# EAGLE board Ell-i-proto (EAGLE 6.4)
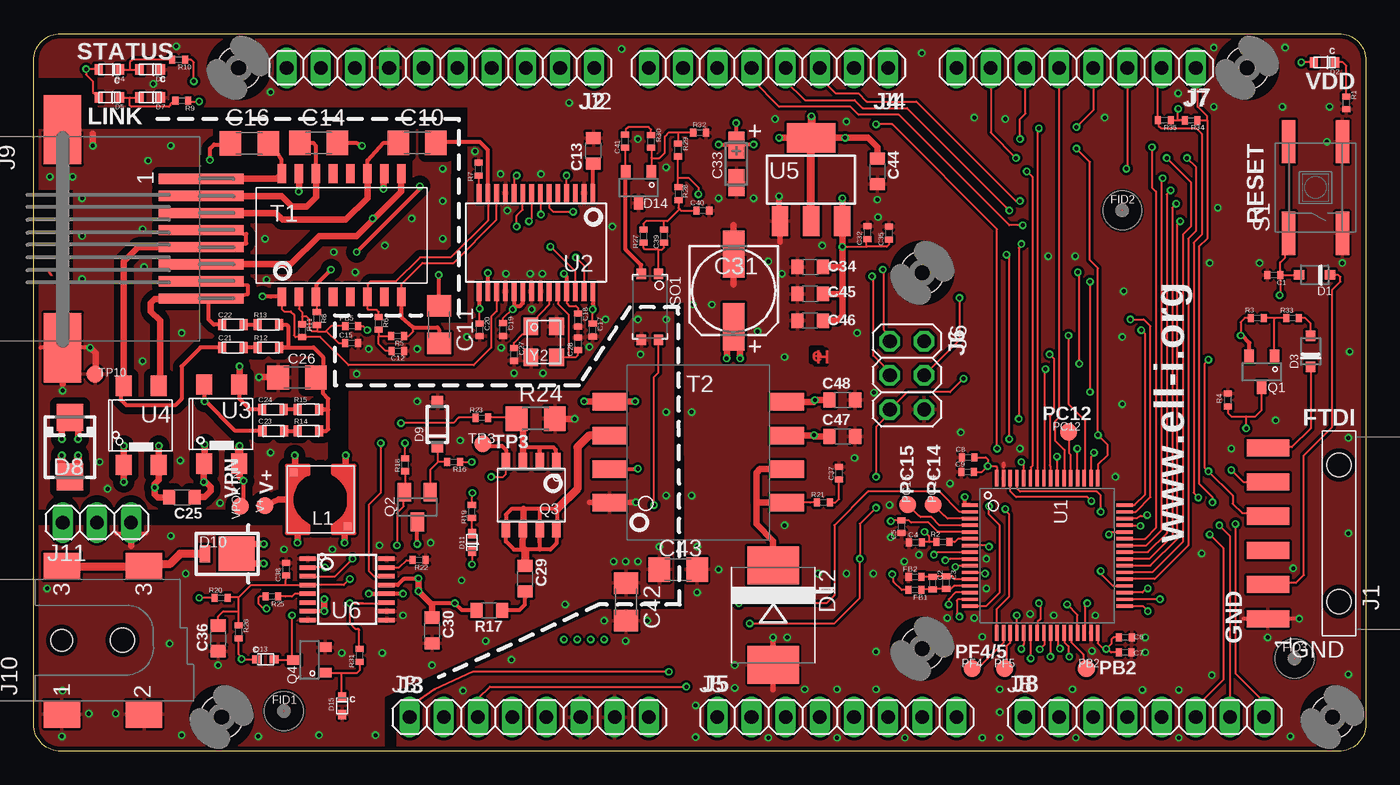
[diagram p3: board, top side]
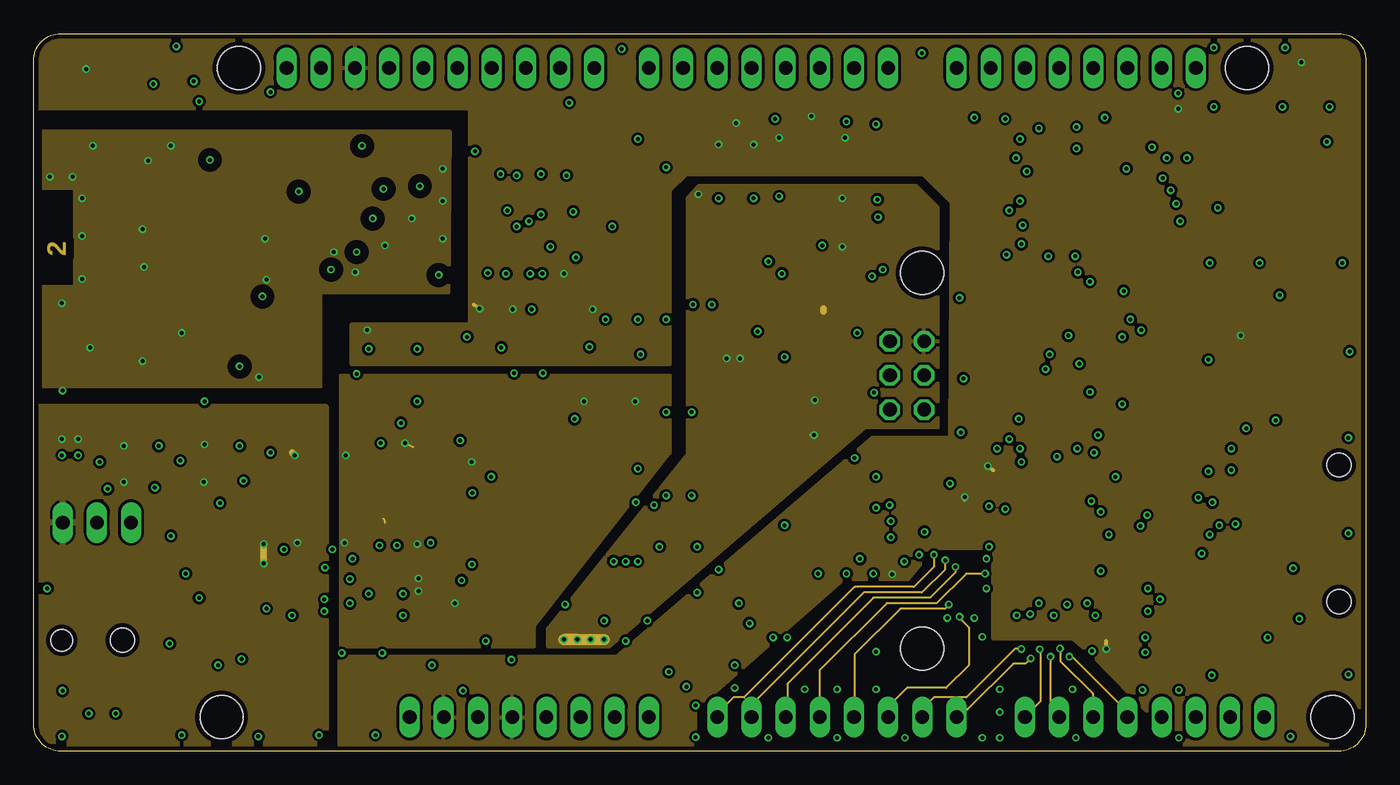
[diagram p4: board, inner layer Layer2]
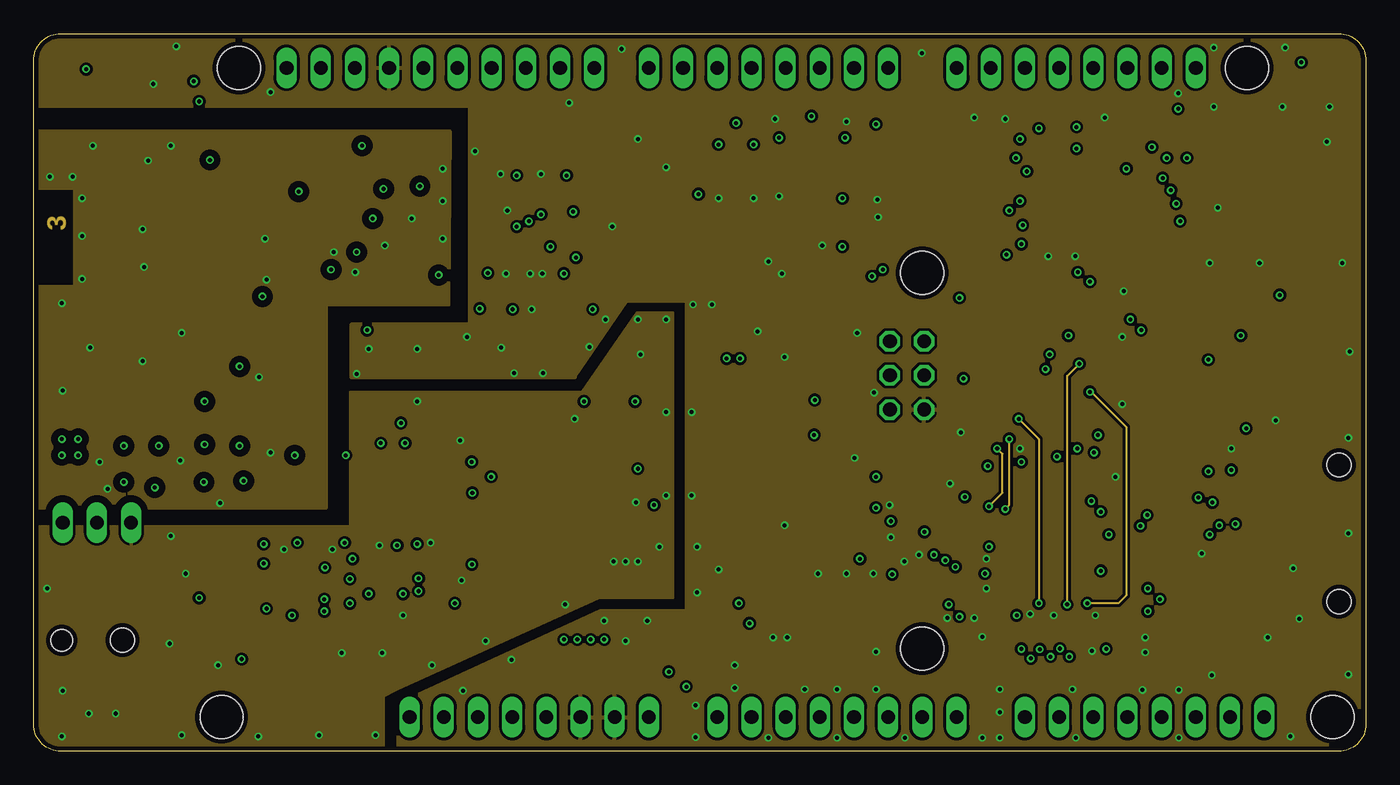
[diagram p5: board, inner layer Layer3]
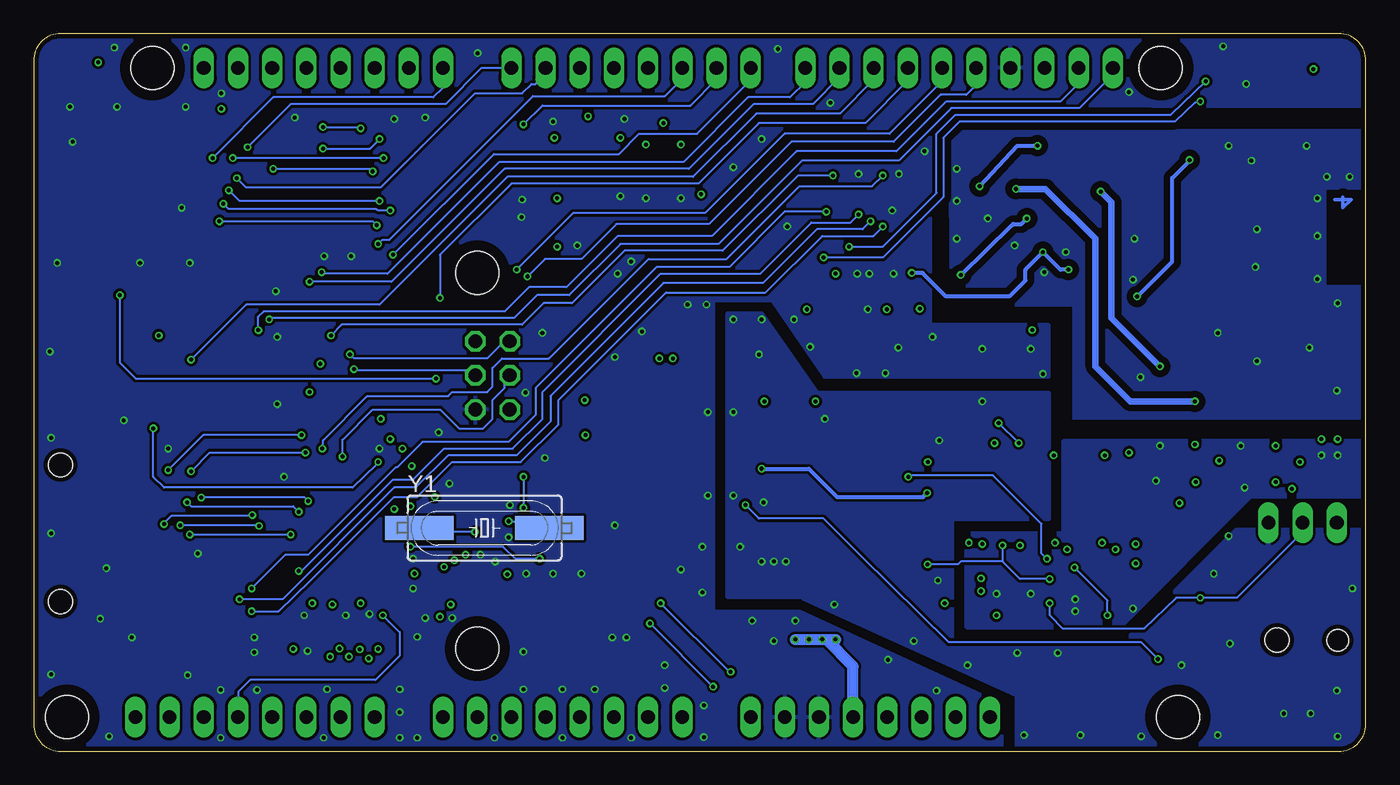
[diagram p6: board, bottom side, seen from below]

Size 99 x 53.34 mm. Coordinates in mm from the lower left corner, seen from the top.
Outline: 97,0 2,0 arc-90 0,2 0,51.34 arc-90 2,53.34 97,53.34 arc-90 99,51.34 99,2 arc-90 97,0
Copper layers (1*2*15*16): Top 0.035mm / dielectric 0.2mm / Layer2 0.035mm / dielectric 1mm / Layer3 0.035mm / dielectric 0.2mm / Bottom 0.035mm
Design rules "Ell-duino *": minimum track width 0.15mm, minimum drill 0.3mm, track to track 0.2mm, track to pad 0.2mm, pad to pad 0.2mm, via to via 0.2mm, smd to smd 0mil, copper to edge 0.35mm, drill to drill 0.4mm, minimum pad ring 10mil, minimum via ring 0.125mm, stop-mask expansion 2mil, vias tented up to drill 0.29mm, thermal gap 0.18mm
Net classes: 0 default: width 0.1 mm, drill 0.3 mm, clearance 0.1 mm; 1 power: width 0.3 mm, drill 0.3 mm, clearance 0.15 mm; 2 high_voltage: width 0.15 mm, drill 0.3 mm, clearance 0.5 mm; 3 high_power: width 0.5 mm, drill 0.3 mm, clearance 0.15 mm
tRestrict: area 37.2,33.9 to 37.5,34.5; area 26,10.1 to 26.5,10.2; area 26,9.4 to 26.5,9.5; area 25.9,14.6 to 26.4,14.7; area 20.1,14.6 to 20.6,14.7; area 20.1,9.4 to 20.6,9.5; area 21.1,21.6 to 21.6,21.6; area 32.6,43.6 to 32.8,43.9; area 36.3,29.1 to 36.4,29.4; area 9.3,49.1 to 9.6,49.2; area 9.3,50.1 to 9.6,50.2; area 20.6,15.9 to 22,16

## Footprints (pad centres in the part's own frame; a part is rotated, then mirrored left to right if it is on the bottom)
0402 = smd 0.45 x 0.6: 1 -0.475,0; 2 0.475,0
C1206 = smd 1.6 x 1.8: 1 -1.4,0; 2 1.4,0
0805 = smd 0.9 x 1.1: 1 -0.95,0; 2 0.95,0
0603 = smd 0.6 x 0.8: 1 -0.8,0; 2 0.8,0
153CLV-0605 = smd 3.5 x 1.6: + 2.7,0; - -2.7,0
CT3216 = smd 2 x 1.2: + -1.4,0; - 1.4,0
SOD323_DIODE = smd 0.8 x 0.7: 1 -1.15,0; 2 1.15,0
DIODE0603 = smd 0.6 x 0.8: 1 -0.8,0; 2 0.8,0
SMA = smd 2 x 2: 1 -2.2,0; 2 2.2,0
SOD-123 = smd 0.85 x 0.85: A 1.675,0; C -1.675,0
SMP = smd 0.762 x 1.27: A 1.651,0 | smd 2.667 x 2.54: C -0.699,0
SOD523 = smd 0.7 x 0.6: 1 -0.65,0; 2 0.65,0
SMC = smd 2.8 x 3.8: 1 -3.7,0; 2 3.7,0
SOT23 = smd 0.7 x 1: 1 -0.95,-1.15; 2 0.95,-1.15; 3 0,1.15
MOUNT_FIDUCIAL = smd 1 x 1: P$1 0,0
MOUNT_HOLE = hole 3.2: 0,0
PS2911 = smd 0.7 x 0.8: 1 -0.635,-2.45; 2 0.635,-2.45; 3 0.635,2.45; 4 -0.635,2.45
TSM-106-01-L-SH-REV = smd 1.27 x 3.17: 1 -6.35,5.28; 2 -3.81,5.28; 3 -1.27,5.28; 4 1.27,5.28; 5 3.81,5.28; 6 6.35,5.28 | hole 1.78: 5.08,0; -5.08,0
1X10 = drill 1.016 long: 1 -11.43,0; 2 -8.89,0; 3 -6.35,0; 4 -3.81,0; 5 -1.27,0; 6 1.27,0; 7 3.81,0; 8 6.35,0; 9 8.89,0; 10 11.43,0
1X08 = drill 1.016 long: 1 -8.89,0; 2 -6.35,0; 3 -3.81,0; 4 -1.27,0; 5 1.27,0; 6 3.81,0; 7 6.35,0; 8 8.89,0
2X03 = drill 1.016 octagon: 1 -2.54,-1.27; 2 -2.54,1.27; 3 0,-1.27; 4 0,1.27; 5 2.54,-1.27; 6 2.54,1.27
85502-5008 = smd 0.76 x 6.35: 1 -4.445,10.3; 2 -3.175,10.3; 3 -1.905,10.3; 4 -0.635,10.3; 5 0.635,10.3; 6 1.905,10.3; 7 3.175,10.3; 8 4.445,10.3 | smd 5.15 x 2.8: S1 -8.1,0; S2 8.1,0
KLDX-SMT2-0202 = smd 2 x 2.7: 1 -5.5,0; 2 -5.5,-6.1; 3@1 5.5,0; 3@2 5.5,-6.1 | hole 1.6: 0,0 | hole 1.8: 0,-4.5
1X03 = drill 1.016 long: 1 -2.54,0; 2 0,0; 3 2.54,0
MSS5121 = smd 0.6 x 0.6: 1 -2,-2; 2 2,2
B1,27 = smd 1.27 x 1.27: TP 0,0
SOT23' = smd 1 x 1.4: 1 -0.95,-1.1; 2 0.95,-1.1; 3 0,1.1
SO8 = smd 0.635 x 1.27: P$1 -1.875,-2.5; P$2 -0.625,-2.5; P$3 0.625,-2.5; P$4 1.875,-2.5; P$5 1.875,2.5; P$6 0.625,2.5; P$7 -0.625,2.5; P$8 -1.875,2.5
R1206 = smd 1.6 x 1.803: 1 -1.422,0; 2 1.422,0
EVQQ2/P0 = smd 3.2 x 1: 1 3.4,-2; 2 -3.4,-2; 3 3.4,2; 4 -3.4,2
H2019NL = smd 0.635 x 1.397: 1 -4.445,-4.572; 2 -3.175,-4.572; 3 -1.905,-4.572; 4 -0.635,-4.572; 5 0.635,-4.572; 6 1.905,-4.572; 7 3.175,-4.572; 8 4.445,-4.572; 9 4.445,4.572; 10 3.175,4.572; 11 1.905,4.572; 12 0.635,4.572; 13 -0.635,4.572; 14 -1.905,4.572; 15 -3.175,4.572; 16 -4.445,4.572
PA1134NL = smd 1.3 x 2.5: 1 3.75,-6.6; 2 1.25,-6.6; 3 -1.25,-6.6; 4 -3.75,-6.6; 5 -3.75,6.6; 6 -1.25,6.6; 7 1.25,6.6; 8 3.75,6.6
LQFP64 = smd 0.25 x 1.2: 1 -3.75,-5.75; 2 -3.25,-5.75; 3 -2.75,-5.75; 4 -2.25,-5.75; 5 -1.75,-5.75; 6 -1.25,-5.75; 7 -0.75,-5.75; 8 -0.25,-5.75; 9 0.25,-5.75; 10 0.75,-5.75; 11 1.25,-5.75; 12 1.75,-5.75; 13 2.25,-5.75; 14 2.75,-5.75; 15 3.25,-5.75; 16 3.75,-5.75; 33 3.75,5.75; 34 3.25,5.75; 35 2.75,5.75; 36 2.25,5.75; 37 1.75,5.75; 38 1.25,5.75; 39 0.75,5.75; 40 0.25,5.75; 41 -0.25,5.75; 42 -0.75,5.75; 43 -1.25,5.75; 44 -1.75,5.75; 45 -2.25,5.75; 46 -2.75,5.75; 47 -3.25,5.75; 48 -3.75,5.75 | smd 1.2 x 0.25: 17 5.75,-3.75; 18 5.75,-3.25; 19 5.75,-2.75; 20 5.75,-2.25; 21 5.75,-1.75; 22 5.75,-1.25; 23 5.75,-0.75; 24 5.75,-0.25; 25 5.75,0.25; 26 5.75,0.75; 27 5.75,1.25; 28 5.75,1.75; 29 5.75,2.25; 30 5.75,2.75; 31 5.75,3.25; 32 5.75,3.75; 49 -5.75,3.75; 50 -5.75,3.25; 51 -5.75,2.75; 52 -5.75,2.25; 53 -5.75,1.75; 54 -5.75,1.25; 55 -5.75,0.75; 56 -5.75,0.25; 57 -5.75,-0.25; 58 -5.75,-0.75; 59 -5.75,-1.25; 60 -5.75,-1.75; 61 -5.75,-2.25; 62 -5.75,-2.75; 63 -5.75,-3.25; 64 -5.75,-3.75
SSOP28DB = smd 0.348 x 1.397: 1 -4.225,-3.656; 2 -3.575,-3.656; 3 -2.925,-3.656; 4 -2.275,-3.656; 5 -1.625,-3.656; 6 -0.975,-3.656; 7 -0.325,-3.656; 8 0.325,-3.656; 9 0.975,-3.656; 10 1.625,-3.656; 11 2.275,-3.656; 12 2.925,-3.656; 13 3.575,-3.656; 14 4.225,-3.656; 15 4.225,3.656; 16 3.575,3.656; 17 2.925,3.656; 18 2.275,3.656; 19 1.625,3.656; 20 0.975,3.656; 21 0.325,3.656; 22 -0.325,3.656; 23 -0.975,3.656; 24 -1.625,3.656; 25 -2.275,3.656; 26 -2.925,3.656; 27 -3.575,3.656; 28 -4.225,3.656
MINIDIP4 = smd 1.2 x 1.5: 1 -1.3,-2.95; 2 1.3,-2.95; 3 1.3,2.95; 4 -1.3,2.95
SOT223 = smd 1.219 x 2.235: 1 -2.311,-3.099; 2 0,-3.099; 3 2.311,-3.099 | smd 3.6 x 2.2: 4 0,3.099
SSOP16 = smd 0.35 x 1.2: 1 -2.275,-2.925; 2 -1.625,-2.925; 3 -0.975,-2.925; 4 -0.325,-2.925; 5 0.325,-2.925; 6 0.975,-2.925; 7 1.625,-2.925; 8 2.275,-2.925; 9 2.275,2.925; 10 1.625,2.925; 11 0.975,2.925; 12 0.325,2.925; 13 -0.325,2.925; 14 -0.975,2.925; 15 -1.625,2.925; 16 -2.275,2.925
SM49 = smd 5.08 x 1.778: 1 -4.826,0; 2 4.826,0
XTAL3225 = smd 1.3 x 1.1: 1 -1.15,-0.95; 2 1.15,-0.95; 3 1.15,0.95; 4 -1.15,0.95

## Placement (x,y rotation side)
C1  100nF  [0402]  92.15,35.39 180 top
C2  1uF  [0402]  66.81,12.49 270 top
C3  10nF  [0402]  67.81,12.53 270 top
C4  22pF  [0402]  65.53,15.51 0 top
C5  22pF  [0402]  64.49,16.69 90 top
C6  100nF  [0402]  81.12,8.45 180 top
C7  1uF  [0402]  81.11,7.35 180 top
C8  1uF  [0402]  69.45,21.85 0 top
C9  100nF  [0402]  69.41,20.75 0 top
C10  10nF  [C1206]  28.5,45.22 0 top
C11  10nF  [C1206]  30.12,31.71 270 top
C12  100nF  [0402]  27.07,29.75 0 top
C13  22uF  [0805]  41.59,44.63 90 top
C14  10nF  [C1206]  21.18,45.22 0 top
C15  100nF  [0402]  23.63,30.35 0 top
C16  10nF  [C1206]  16.03,45.18 180 top
C17  100nF  [0402]  41.55,31.31 270 top
C18  100nF  [0402]  40.45,32.05 270 top
C19  100nF  [0402]  34.9,31.35 270 top
C20  100nF  [0402]  33.15,31.33 270 top
C21  10nF  [0603]  14.82,30.01 0 top
C22  10nF  [0603]  14.81,31.71 0 top
C23  10nF  [0603]  17.8,23.81 0 top
C24  10nF  [0603]  17.79,25.41 0 top
C25  100nF  [0805]  11.03,18.88 180 top
C26  1nF  [C1206]  19.57,27.78 180 top
C27  22pF  [0402]  35.7,29.5 270 top
C28  22pF  [0402]  40.45,30.29 90 top
C29  68pF  [0805]  36.52,12.84 270 top
C30  1uF  [0805]  29.62,8.98 270 top
C31  [153CLV-0605]  52.02,34.25 270 top
C32  100nF  [0402]  61.95,38.55 90 top
C33  opt tant  [CT3216]  52.22,43.65 270 top
C34  22u  [0805]  57.7,36 180 top
C35  47pF  [0402]  63.55,38.51 90 top
C36  4u7  [0805]  13.72,8.39 270 top
C37  470pF  [0402]  59.85,20.67 90 top
C38  100nF  [0402]  18.75,13.53 90 top
C39  33nF  [0402]  46.85,38.29 90 top
C40  [0402]  49.73,40.19 0 top
C41  27nF  [0402]  43.95,45.35 90 top
C42  1n 2kV  [C1206]  44.02,11.1 270 top
C43  1n 2kV  [C1206]  47.9,13.5 0 top
C44  22u  [0805]  62.7,43.1 270 top
C45  22u  [0805]  57.7,34 180 top
C46  22u  [0805]  57.7,32 180 top
C47  22u  [0805]  60.1,23.4 0 top
C48  22u  [0805]  60.1,26.1 0 top
D1  BAT60J  [SOD323_DIODE]  95.19,35.4 180 top
D2  GRN  [DIODE0603]  95.92,51.19 180 top
D3  BAT60J  [SOD323_DIODE]  94.9,29.73 90 top
D4  STATUS  [DIODE0603]  5.63,50.67 180 top
D5  LINK  [DIODE0603]  5.63,48.59 180 top
D6  STATUS  [DIODE0603]  8.66,50.67 180 top
D7  LINK  [DIODE0603]  8.66,48.59 180 top
D8  [SMA]  2.7,22.6 270 top
D9  MMSZ4694  [SOD-123]  30,24.29 90 top
D10  SS2PH10  [SMP]  14.38,14.68 180 top
D11  BAS516  [SOD523]  32.57,15.53 90 top
D12  MBRS540T3  [SMC]  54.96,10.12 270 top
D13  BAS516  [SOD523]  17.22,6.83 0 top
D14  TLVH431B  [SOT23]  44.95,41.9 180 top
D15  BAS516  [SOD523]  22.93,3.39 270 top
FB1  BLM15A  [0402]  65.49,11.99 180 top
FB2  BLM15A  [0402]  65.5,12.96 0 top
FB5  BLM15A  [0402]  23.64,31.61 0 top
FID1  MOUNT_FIDUCIAL  [MOUNT_FIDUCIAL]  18.6,3 0 top
FID2  MOUNT_FIDUCIAL  [MOUNT_FIDUCIAL]  80.9,40.2 0 top
FID3  MOUNT_FIDUCIAL  [MOUNT_FIDUCIAL]  93.7,6.9 0 top
H1  MOUNT_HOLE  [MOUNT_HOLE]  15.24,50.8 0 top
H2  MOUNT_HOLE  [MOUNT_HOLE]  13.97,2.54 0 top
H3  MOUNT_HOLE  [MOUNT_HOLE]  66.04,35.56 0 top
H4  MOUNT_HOLE  [MOUNT_HOLE]  66.04,7.62 0 top
H5  MOUNT_HOLE  [MOUNT_HOLE]  90.17,50.8 0 top
H6  MOUNT_HOLE  [MOUNT_HOLE]  96.52,2.54 0 top
ISO1  PS2911  [PS2911]  45.8,33.03 180 top
J1  FTDI-SER-6-HOR2  [TSM-106-01-L-SH-REV]  97,16.2 90 top
J2  PWMH  [1X10]  30.23,50.8 180 top
J3  PWR  [1X08]  36.83,2.54 0 top
J4  PWML  [1X08]  54.61,50.8 180 top
J5  ANAL  [1X08]  59.69,2.54 0 top
J6  SPI  [2X03]  64.9,27.94 270 top
J7  COMM  [1X08]  77.47,50.8 0 top
J8  ANAH  [1X08]  82.55,2.54 0 top
J9  RJ45  [85502-5008]  2.15,38.1 270 top
J10  KLDX-SMT2-0202  [KLDX-SMT2-0202]  2.1,8.26 90 top
J11  [1X03]  4.7,17 0 top
L1  3u3  [MSS5121]  21.32,18.71 270 top
PB2  TPSB1,27  [B1,27]  78.23,6.13 0 top
PC12  TPSB1,27  [B1,27]  76.91,23.73 0 top
PC14  TPSB1,27  [B1,27]  66.86,18.33 0 top
PC15  TPSB1,27  [B1,27]  64.96,18.33 0 top
PF4  TPSB1,27  [B1,27]  69.75,6.13 0 top
PF5  TPSB1,27  [B1,27]  72.17,6.13 0 top
Q1  FDV304P  [SOT23]  91.26,28.2 180 top
Q2  MMBTA42  [SOT23']  28.51,18.15 180 top
Q3  Si4848DY  [SO8]  36.98,19.03 180 top
Q4  FDV301N  [SOT23]  20.5,6.79 90 top
R1  150R  [0402]  97.55,48.19 270 top
R2  390R  [0402]  67.57,15.55 0 top
R3  10K  [0402]  90.93,32.2 0 top
R4  10K  [0402]  88.75,26.11 270 top
R5  49R9  [0402]  27.05,30.85 180 top
R6  49R9  [0402]  25.65,31.81 90 top
R7  2K2  [0402]  33.05,43.27 90 top
R8  49R9  [0402]  21.05,32.17 270 top
R9  330R  [0402]  11.01,48.35 180 top
R10  330R  [0402]  10.77,51.41 180 top
R11  49R9  [0402]  19.94,31.26 270 top
R12  75R  [0603]  17.45,30.01 0 top
R13  75R  [0603]  17.44,31.71 0 top
R14  75R  [0603]  20.43,23.81 0 top
R15  75R  [0603]  20.42,25.41 0 top
R16  220K  [0402]  31.2,21.51 180 top
R17  100R  [0805]  33.86,10.48 180 top
R18  220K  [0402]  27.59,21.29 270 top
R19  510R  [0402]  32.56,17.82 90 top
R20  100K  [0402]  13.93,11.39 0 top
R21  10R  [0402]  58.69,18.49 0 top
R22  8K06  [0402]  28.65,14.21 180 top
R23  4K7  [0402]  33.31,24.79 0 top
R24  0R125  [R1206]  37.31,24.72 0 top
R25  45R3  [0402]  17.7,11.5 180 top
R26  6K8  [0402]  15.24,8.87 270 top
R27  1K  [0402]  45.31,38.29 90 top
R28  470R  [0402]  47.91,41.45 90 top
R29  100K  [0402]  47.89,44.69 270 top
R30  47K  [0402]  45.89,45.33 270 top
R31  10K  [0402]  24.21,7.13 90 top
R32  33K2  [0402]  49.49,45.99 0 top
R33  1K  [0402]  93.55,32.19 0 top
R34  2K2  [0402]  86.01,46.89 0 top
R35  2K2  [0402]  84.03,46.91 180 top
S1  EVQQ2/P0  [EVQQ2/P0]  95.26,41.9 90 top
T1  H2019  [H2019NL]  22.89,38.35 0 top
T2  PA1134NL  [PA1134NL]  49.39,22.22 270 top
TP3  TPB1,27  [B1,27]  33.39,22.85 0 top
TP10  TPB1,27  [B1,27]  4.57,28.03 90 top
U1  STM32F05XLQF64  [LQFP64]  75.32,14.54 270 top
U2  ENC28J60SS  [SSOP28DB]  37.33,37.81 180 top
U3  HD01  [MINIDIP4]  13.97,24.32 0 top
U4  HD01  [MINIDIP4]  7.98,24.22 0 top
U5  NCP1117  [SOT223]  57.77,42.49 0 top
U6  LTC4267  [SSOP16]  23.29,12.03 270 top
U$4  [EH-LOGO]  58.1,28.8 0 top
V+  TPB1,27  [B1,27]  17.18,18.25 0 top
VPORTN  TPB1,27  [B1,27]  15.38,18.23 0 top
Y1  [SM49]  65.5,16.6 0 bottom
Y2  25MHz  [XTAL3225]  37.9,30.43 270 top

## Tracks (layer width: path | path; a pad name or v marks a point on that pad's centre or on a via)
+3V3  (via drill 0.3)
  Top 0.15: R35.1 85.52,46.91 | U2.25 39.6,33.3 39.8,33.1 40.3,33.1 40.45,32.95 C18.1 | D4.2 4.8,50.7 v3.9,50.7 3.9,50.3 4.4,49.8 4.4,49 4.8,48.7 4.88,48.62 4.9,48.62 D5.2 | FB1.2 64.51,11.99 63.9,12.6 63.9,13 63.8,13.1 v63.8,13.15 | R34.1 85.5,46.9 85.48,46.91 85.03,46.91 85.03,47.69 v85.05,47.75 | C20.1 v33.15,32.9 | C17.1 v41.55,32.85 41.6,32.8 | 95.1,51.2 v94.2,51.2 | FB5.2 24.09,31.61 24.1,31.6 24.5,31.6 v24.8,31.31 v24.79,31.31 | C19.1 34.9,32.2 35.58,32.88 | R3.1 90,32.2 89.7,31.9 v89.7,30.9 | Q1.2 | v70.9,21.2 71.5,21.2 71.6,21.1 71.6,20.32 U1.64 | v70.9,21.2 70.8,21.2 70.7,21.3 | C8.2 70.75,21.85 70.9,21.7 v70.9,21.2 | C9.2 70.45,20.75 v70.9,21.2 | U1.32 79.07,8.03 79.5,7.6 v79.7,7.6 | C7.2 80.06,7.34 v79.7,7.6 | C6.2 80.25,8.45 80.1,8.3 80.1,8 v79.7,7.6
  Top 0.3: 85.52,46.91 R34.1 | C7.2 | U1.1 69.21,18.29 69.2,18.3 v69.2,18.9 | Q1.2 90.4,29.3 90.35,29.35 90.35,30.35 89.8,30.9 v89.7,30.9 | U2.15 33.1,33.01 v33.15,32.9 | U2.19 35.7,33.05 | 35.7,33.05 35.7,32.9 v35.6,32.85 | U2.20 36.35,33.3 36.1,33.05 35.7,33.05 | 35.7,33.05 v35.6,32.85 | U2.28 41.55,33.26 v41.55,32.85 | v41.55,32.85 | 41.56,32.81 v41.55,32.85 | v39.4,35.5 39.6,35.3 U2.25 | v55.4,45.6 57.5,45.6 | v50.9,45.1 52.2,45.1 | v53.5,45.1 52.2,45.1 | v52.2,46.7 52.2,45.1 | D2.2 95.12,51.22 95.1,51.2 | 35.58,32.88 v35.6,32.85 | 35.7,33.05 v35.6,32.85
  Top 0.5: 57.8,45.6 v55.4,45.6 | 58.9,45.6 v60.3,45.6 62,45.6 62.7,44.9 C44.1 | 52.2,45.1 52.2,45.07 C33.+
  Top 0.6: v57.8,47.2 57.8,45.6 | 57.8,45.6 57.5,45.6 57.61,45.59 U5.4 U5.2 | 57.8,45.6 58.9,45.6
  Layer2 0.3: v79.7,7.6 79.7,8.2 | v69.2,18.9 69.2,18.7 | v70.9,21.2 71.3,20.9 | v63.8,13.15 63.8,13.2 | v85.05,47.75 85,47.7 | v33.15,32.9 32.7,33.2 | v35.6,32.85 35.7,33 | v3.9,50.7 3.8,50.7 | v24.79,31.31 24.8,31.41 24.8,31.4
  pour Layer2: -0.7,47.8 32.4,47.8 32.4,31.7 23.6,31.7 23.6,28.8 47.3,28.8 47.3,41.7 48.5,42.9 66.1,42.9 68.2,40.8 68.1,23.3 62.3,23.3 43.3,7 22.7,7 22.7,-1.3 49.2,-1.2 49.2,3.1 60.2,12.8 65,12.8 66.9,15.1 70.7,15.1 71.3,14.3 71.3,8.4 77.2,8.4 78.6,7.2 86.1,-0.5 99.5,-0.5 99.5,53.7 25.5,53.9 -0.7,53.8
+5V  (via drill 0.3)
  Top 0.15: 47.9,42.63 48.67,42.63 49.4,41.9 v49.4,41.4 | 47.9,41.9 47.9,42.63 | 47.9,42.63 R29.2 | v60.1,37.5 61.9,37.5 | 61.9,37.5 61.9,38.02 C32.1 | C35.1 63.55,37.65 63.4,37.5 61.9,37.5
  Top 0.3: R28.2 47.9,41.9 | 49.42,41.33 v49.4,41.4
  Top 0.5: T2.6 57.97,23.47 v58,23.5 58,23.4 C47.1 | T2.5 57.98,25.97 v58.05,26.1 C48.1 | C31.+ 51.52,30.5 | 51.52,30.5 51.52,29.32 v51.5,29.2 | v52.5,29.2 52.5,30.4 51.72,30.3 51.52,30.5 | v60.1,41.1 60.1,39.5 60.07,39.2 U5.3 | 60.1,38.8 v60.1,37.5 60.1,36 | C34.1 60.1,36 | C45.1 60.1,34 | 60.1,34 60.1,36 | C46.1 59.7,32 60.1,32.4 60.1,34
  Layer2 0.5: v58,23.5 57.9,23.5 | 58.7,32.7 58.7,32.9
  Layer2 0.8: v40.4,8.3 v39.4,8.3 | v39.4,8.3 v41.4,8.3 | v39.4,8.3 v42.4,8.3
  Bottom 0.8: J3.5 38.1,6.3 40.1,8.3 | v41.4,8.3 v40.4,8.3 | v40.4,8.3 40.1,8.3 | 40.1,8.3 v39.4,8.3 | v42.4,8.3 v40.4,8.3
  pour Layer2: 67.2,24.1 67.2,40.4 65.6,42 49.4,42 48.6,41.1 48.6,22.1 38.2,9.1 38.2,7.8 42.8,7.8 61.8,24.1
AD0  (via drill 0.3)
  Top 0.15: U1.8 67.19,14.79 v66.9,14.6
  Layer2 0.15: v66.9,14.6 66.9,13.7 65.4,12.2 61,12.2 52.8,4 52,4 50.8,2.8 J5.1
AD1  (via drill 0.3)
  Top 0.15: U1.9 68.09,14.29 v67.75,14.2
  Layer2 0.15: J5.2 53.5,2.7 53.5,3.6 61.7,11.8 66,11.8 67.75,13.5 v67.75,14.2
AD2  (via drill 0.3)
  Top 0.15: U1.10 68.69,13.79 v68.5,13.7
  Layer2 0.15: v68.5,13.7 68.5,13.3 66.6,11.4 62.4,11.4 56,5 56,2.66 J5.3
AD3  (via drill 0.3)
  Top 0.15: U1.11 70.61,13.29 v70.7,13.2
  Layer2 0.15: v70.7,13.2 69.3,13.2 67.1,11 63.4,11 58.4,6 58.4,2.72 J5.4
AD4  (via drill 0.3)
  Top 0.15: U1.14 68.49,11.79 68,11.3 v68,10.9
  Layer2 0.15: v68,10.9 67.7,10.6 64.4,10.6 61,7.2 61,2.58 J5.5
AD5  (via drill 0.3)
  Top 0.15: U1.15 68.69,11.29 68.6,11.2 68.6,10.2 v68.8,10
  Layer2 0.15: v68.8,10 68.8,9.9 69.5,9.2 69.5,6.4 67.8,4.7 64.9,4.7 63.6,3.4 63.6,2.64 J5.6
AD6  (via drill 0.3)
  Top 0.15: U1.21 73.57,7.97 73.4,7.7 v73.4,7.6
  Layer2 0.15: v73.4,7.6 72.9,7.6 69.3,4 66.9,4 66.1,3.2 66.1,2.6 J5.7
AD7  (via drill 0.3)
  Top 0.15: U1.22 74.07,6.97 v74.1,6.9
  Layer2 0.15: v74.1,6.9 73.7,6.5 72.8,6.5 69.4,3.1 68.7,2.6 68.6,2.56 J5.8
AD8  (via drill 0.3)
  Top 0.15: U1.24 75.1,8.4 75.1,7.9 v74.77,7.57
  Layer2 0.15: v74.77,7.57 74.8,7.5 74.8,3.7 73.8,2.7 73.8,2.68 J8.1
AD9  (via drill 0.3)
  Top 0.15: U1.25 v75.57,7.03
  Layer2 0.15: v75.57,7.03 75.57,3.43 76.1,2.9 76.1,2.64 J8.2
AD10  (via drill 0.3)
  Top 0.15: U1.26 76.1,8.6 76.1,7.8 v76.27,7.63
  Layer2 0.15: v76.27,7.63 76.3,7.6 76.3,6.7 78.7,4.3 78.7,2.58 J8.3
AD11  (via drill 0.3)
  Top 0.15: U1.27 76.6,8.5 76.6,8.1 76.9,7.8 76.9,7.1 v76.97,7.03
  Layer2 0.15: v76.97,7.03 77.1,7 77.2,7 80.8,3.4 81.1,3.2 81.1,2.72 J8.4
DAC1  (via drill 0.3)
  Top 0.15: U1.20 73.07,8.43 73.05,8.8 v73.05,10.1
  Bottom 0.15: v73.05,10.1 71.8,8.85 71.8,7.1 73.6,5.3 82.9,5.3 83.8,4.4 83.8,2.56 J8.5
GND  (via drill 0.3)
  Top 0.3: 6.1,16.2 8.4,16.2
  Top 0.4: 41.3,18.5 v44.75,18.5
  Top 0.5: v40.2,24.7 38.8,24.7 | J11.3 7.25,15.25
  other vias: 28.5,26 44.9,14.1 44,14.1 43.1,14.1 39.5,10.9 29.6,6.4 25.4,1.2 25.9,7.3 21.2,1.2 16.7,1.1 11,1.2 6.1,2.8 4.1,2.8 2.1,1.1 2.15,4.5 1,12.1 10.1,8 47,32.1 44.9,32.1 45.1,29.5 47,25.2 10.2,16 18.6,15 11.3,13.2 25.7,15.3 27.45,10.1 31.7,23.1 29.5,15.5 22.9,7.3 13.7,6.4 47,19 31.8,12.7 33.6,8.2 46.5,15.2 22.2,15
  pour Top: -0.5,-0.7 26.05,-0.7 26.05,4.1 26.1,4.1 42.05,11.35 47.55,11.35 47.55,32.65 44.85,32.65 40.7,26.75 23.45,26.75 23.45,16.75 -0.7,16.75
  pour Layer3: -1.3,-0.7 26,-0.7 26,4.1 27,4.6 42,11.4 47.5,11.4 47.5,32.6 44.85,32.6 40.75,26.7 23.5,26.7 23.5,16.7 -1.3,16.7
  pour Bottom: -0.5,-0.7 25.9,-0.7 25.9,4.2 41.8,11.4 42,11.5 47.4,11.5 47.4,32.5 44.9,32.5 40.8,26.6 23.6,26.6 23.6,17.3 30.8,17.3 30.8,8.2 17.8,8.2 9.6,16.4 -0.7,16.4
GNDI  (via drill 0.3)
  Top 0.3: 78.57,7.53 v78.65,7.45 | 72.07,21.37 72.1,21.2 | 78.78,10 v78.9,10.1 | R7.2 32.9,43.74 | v32.8,44.6 32.95,44.5 | v94.05,9.85 89.9,9.85
  Top 0.4: v55.4,41.25 55.45,37.85 | v54.95,8.45 54.95,4.55
  Top 0.5: 52,39.1 52,34.7
  other vias: 65.8,14.6 64.7,14.1 49.2,1.05 49.2,3.4 52.1,4.7 52.1,6.4 58.3,13.2 60.4,13.2 70.8,14.3 70.8,12.1 74.05,10.2 75.8,10.1 82.4,4.55 85.1,4.55 75.4,36.8 81,34.2 80.9,30.8 80.9,25.8 87.4,36.3 55.8,16.8 28.5,29.9 24.9,29.9 35.2,40.2 37.8,35.5 36.9,35.5 35.1,35.5 44,8.2 45.6,9.7 42.4,9.7 50.9,13.5 49.3,15.2 49.3,11.8 24,28.05 37.85,28.1 35.7,28.1 42.5,32.1 41.3,30.05 50.9,41.1 44.9,45.5 43,39 10.6,52.4 17.6,49 8.9,49.6 54.6,36.4 49,33.2 58.6,37.6 62.7,41 87.7,47.9 85.05,48.9 79.6,47.1 93,52.3 87.7,52.3 96.1,45.3 96.3,47.9 97.25,36.3 91.1,36.3 97.8,29.7 97.7,23.3 97.7,16.2 91.7,8.45 93.4,1.1 97.7,5.7 87.55,5.65 82.6,8.45 82.6,7.35 68.1,19.9 68.9,23.7 73.3,22.5 80.4,20.4 63.6,18.3 63.7,15.9 62.4,13.2 70.5,1 71.8,1 85.1,1 59.7,1 86.8,14.7 69.9,9.9 67.9,9.9 62.6,7.4 62.6,4.6 71.8,4.6 70.5,8.5 59.7,4.6 57.3,4.6 77.4,36.8 69.9,47.1 66,51.9 89,22.5 92.3,24.6 93.6,13.6 92.8,47.9 43.7,52.2 53.5,41.1 47,43.4 72.2,47 88,40.4 34.7,42.9 32.2,30.8 34.75,30 35.5,6.8 60.4,46.8 55.1,47 48.9,25.2 48.9,19 61.2,31.1 62.75,39.7 55.8,29.3 31.9,4.5 77.2,4.6 71.8,2.9 54.6,1 64.75,1 77.45,1 37.01,32.85 61,21.8 62.45,26.65 39.8,48.2 37.7,42.9 55.6,35.5 53.8,31.2 50.4,33.2 56,8.45
  pour Top: -0.5,53.9 -0.6,50.1 4.8,50.1 4.8,47.9 32.3,47.9 32.3,31.8 23.5,31.8 23.5,27.7 40.25,27.7 44.15,33.4 48.35,33.4 48.4,10.5 42.1,10.5 27,3.55 27,-0.6 99.6,-0.6 99.6,54
  pour Layer3: -0.7,53.9 -0.7,48 32.4,48 32.4,31.7 23.6,31.7 23.6,27.8 40.2,27.8 44.1,33.5 48.5,33.5 48.5,10.4 42.1,10.4 27.1,3.5 27.1,-0.6 99.6,-0.6 99.6,54
  pour Bottom: -0.6,53.8 -0.6,47.9 32.4,48 32.4,31.7 23.6,31.7 23.6,27.8 40.2,27.8 44.1,33.5 48.5,33.5 48.5,10.4 42.1,10.4 27.1,3.5 27.1,-0.6 99.6,-0.6 99.6,54
IO2  (via drill 0.3)
  Top 0.15: J4.3 58.42,50.08 59.6,48.9 61.3,48.9 61.9,48.3 65.6,48.3 73,40.9 v73.3,40.9 | v84.5,41.7 84.2,41.4 84.2,16.2 82.8,14.8 U1.41
  Bottom 0.15: v73.3,40.9 83.7,40.9 v84.5,41.7
IO3  (via drill 0.3)
  Top 0.15: J4.4 55.88,49.82 57.3,48.4 61,48.4 61.6,47.8 64.9,47.8 v72.5,40.2 | v84.9,40.7 84.6,40.4 84.6,16 82.9,14.3 U1.40
  Bottom 0.15: v72.5,40.2 73.4,40.2 73.6,40.3 84.5,40.3 v84.9,40.7
IO4  (via drill 0.3)
  Top 0.15: U1.39 81.39,13.79 81.5,13.8 83,13.8 85,15.8 85,39.2 v85.2,39.4 | v73.5,39.1 72.5,39.1 64.3,47.3 61.3,47.3 60.7,47.9 55.4,47.9 53.4,49.9 53.4,50.74 J4.5
  Bottom 0.15: v85.2,39.4 73.8,39.4 v73.5,39.1
IO5  (via drill 0.3)
  Top 0.15: v73.4,37.7 73.2,37.4 v73.2,24.7 | v74.7,11 74.8,10.8 74.8,9.8 74.6,9.6 74.6,8.82 U1.23
  Layer3 0.15: v73.2,24.7 74.7,23.2 v74.7,11
  Bottom 0.15: v73.4,37.7 73.1,38 72.6,38 61.9,48.7 52.1,48.7 50.8,50 J4.6
IO6  (via drill 0.3)
  Top 0.15: U1.16 70.79,10.79 71.8,11.8 71.8,16.8 71,17.6 v71,18.2 | v71.6,22.5 71.6,38.8 63.8,46.6 v62.6,46.6
  Layer3 0.15: v71,18.2 72,19.2 72,22.1 v71.6,22.5
  Bottom 0.15: J4.7 48.3,50.76 48.3,49.9 50.2,48 61.2,48 v62.6,46.6
IO7  (via drill 0.3)
  Top 0.15: U1.17 71.57,10.57 72.5,11.5 72.5,17.6 72.2,17.9 v72.2,18 | v72.5,23.2 72.5,36.7 v72.3,36.9
  Layer3 0.15: v72.2,18 72.5,18.3 v72.5,23.2
  Bottom 0.15: v72.3,36.9 64.8,44.4 55.5,44.4 54,45.9 49.7,45.9 45.9,49.7 45.9,50.62 J4.8
IO8  (via drill 0.3)
  Top 0.15: U1.29 77.57,10.13 v76.8,10.9 | v77.7,28.8 77.7,35.5 v77.6,35.6
  Layer3 0.15: v76.8,10.9 76.8,27.9 v77.7,28.8
  Bottom 0.15: J2.1 41.66,49.74 42.8,48.6 45.9,48.6 50.7,43.8 64.4,43.8 72.7,35.5 77.5,35.5 v77.6,35.6
IO9  (via drill 0.3)
  Top 0.15: v78.5,34.9 v78.5,26.7 | v78.3,11 78.1,10.8 78.1,8.82 U1.30
  Layer3 0.15: v78.5,26.7 78.6,26.7 81.2,24.1 81.2,11.6 80.6,11 v78.3,11
  Bottom 0.15: J2.2 39.12,50.08 41.1,48.1 45.5,48.1 50.3,43.3 64,43.3 72.4,34.9 v78.5,34.9
MAG-CT-1  (via drill 0.3)
  Top 0.3: 15.3,27.3 U3.3 15.3,27.04 15.3,26.2 16.09,25.41 C24.1
  Top 0.5: T1.15 19.71,41.62 v19.7,41.6 | v15.3,28.6 15.3,27.3
  Bottom 0.5: v19.7,41.6 18.9,40.8 18.9,32.2 v15.3,28.6
MAG-CT-2  (via drill 0.3)
  Top 0.3: C23.1 14.99,23.81 12.7,26.1 | U3.4 12.7,27.04 12.7,27 12.7,26.1 | 12.7,26.1 v12.7,26
  Top 0.5: v26,41.8 26,42.86 T1.10
  Bottom 0.5: v12.7,26 17.5,26 20.1,28.6 20.1,38.1 23.8,41.8 v26,41.8
MISO1  (via drill 0.3)
  Top 0.15: v75.5,29.5 75.8,29.2 75.8,25.2 75.5,24.9 75.5,21.25 75.55,21.2 75.55,20.55 U1.56 | J6.1 63.63,30.87 63.2,31.3 63.2,35.7 v63.1,35.8
  Bottom 0.15: J6.1 64.02,30.48 65.3,29.2 75.2,29.2 v75.5,29.5 | J2.5 31.5,49.8 35.4,45.9 43.2,45.9 49.1,40 58.9,40 v63.1,35.8
MISO_ETH  (via drill 0.3)
  Top 0.15: U2.6 38.3,40.4 38.6,40.1 v40.1,40.1 | v82.8,12.1 82.7,12.1 82.4,11.8 U1.35
  Bottom 0.15: v40.1,40.1 43.2,40.1 47.3,36 52.7,36 61.7,27 61.7,25 63.7,23 70.1,23 72,21.1 72.1,21.1 78.6,14.6 80.3,14.6 v82.8,12.1
MOSI1  (via drill 0.3)
  Top 0.15: v75.2,28.4 75.2,28.3 75.1,28.2 75.1,20.36 U1.57 | v68.8,33.7 68.8,30.57 J6.4
  Bottom 0.15: J6.4 66.44,27.94 66.8,28.3 75.1,28.3 v75.2,28.4 | J2.4 34.04,49.86 37.2,46.7 45.1,46.7 49.6,42.2 63.5,42.2 68.8,36.9 v68.8,33.7
MOSI_ETH  (via drill 0.3)
  Top 0.15: v37.7,39.9 37.7,41.42 U2.7 | v79.3,13.4 79.3,13.2 80.2,12.3 U1.36
  Bottom 0.15: v37.7,39.9 38.3,39.3 41.2,39.3 45,35.5 52.4,35.5 61.2,26.7 61.2,24.7 63.4,22.5 68.5,22.5 70.8,20.2 72.3,20.2 79.1,13.4 v79.3,13.4
N08557  (via drill 0.3)
  Top 0.15: R8.1 21.05,33.61 T1.3
  Top 0.3: 22.8,45.3 22.78,45.22 C14.2 22.6,45.2 24,45.2 v24.4,45 | v22.1,35.8 21,34.7 21,33.79 T1.3 | v33.75,35.55 U2.16 | v24,37.1 28.6,41.7 v28.7,42
  Bottom 0.3: v33.75,35.55 32.95,35.55 31.2,33.8 26.5,33.8 25.3,35 25.3,35.8 v24,37.1 22.7,35.8 v22.1,35.8 | v28.7,42 25.9,45 v24.4,45
N08738  (via drill 0.3)
  Top 0.15: T1.1 18.45,32.85 18.6,32.7 19.1,32.7 19.35,32.45 19.35,30.9 19.46,30.79 R11.2 19.8,30.8 20.3,30.8 | U2.17 34.41,32.7 34,32.3 34,30 32.7,28.7 23.4,28.7 21.3,30.8 20.3,30.8 | 20.3,30.8 19.84,30.8 20.3,30.8 | 20.3,30.8
  Top 0.3: T1.1 17.62,33.78 v17,33.8 | v13.1,43.95 13.1,44.8 13.4,45.1 14.5,45.1 14.49,45.15 C16.2
  Bottom 0.3: v17,33.8 14.4,36.4 14.4,42.6 13.1,43.9 v13.1,43.95
N08782
  Top 0.15: U2.13 33.76,39.45 31,36.7 28.7,36.7 26.9,34.9 25,34.9 24.8,34.7 T1.6 | 24.82,33.76 T1.6 | R6.2 25.65,32.65 25.5,32.8 24.9,32.8 24.8,32.9 T1.6
  Top 0.3: C10.2 29.8,45.2 29.8,45.3 33.15,45.3 33.75,44.7 33.75,41.51 U2.13
N08928
  Top 0.15: U2.12 34.4,41.27 34.4,39.5 31.2,36.3 28.9,36.3 27.34,34.73 T1.8 27.35,33.66 | R5.1 27.85,30.85 28.2,31.2 28.2,31.5
  Top 0.3: C11.2 30.13,31.35 30,31.5 28.2,31.5 27.35,32.25 27.35,33.66
N12266
  Top 0.15: T1.2 19.71,32.88 19.95,32.65 19.95,32.3 | 21.1,31.21 21.71,31.21 21.75,31.25 | R8.2 21.05,31.26 21.1,31.21 | 19.95,32.3 R11.1 | 21.1,31.21 20.69,31.21 20.5,31.4 20.5,32.1 20.3,32.3 19.95,32.3 | 21.75,31.25 22.65,30.35 C15.1 | FB5.1 23.14,31.61 23.2,31.6 22.1,31.6 21.75,31.25
N12583
  Top 0.15: U2.14 33.1,42.86 R7.1
N13468
  Top 0.15: 39.75,29.3 39.1,29.3 39.15,29.25 39.1,29.2 39.02,29.28 Y2.3 39,29.53 | C28.1 40.45,29.45 40.3,29.3 39.8,29.3 39.75,29.3 | U2.24 38.95,33.24 39.75,32.45 39.75,29.3
N13660
  Top 0.15: U2.23 38.3,33.2 37.2,32 37,31.73 Y2.1 | 36.87,31.6 Y2.1 | C27.1 35.7,30.35 36.35,31 36.85,31 Y2.1
N14101
  Top 0.3: U2.1 41.55,43.56 C13.1
N16078
  Top 0.15: R6.1 25.65,30.85 | 25.65,30.85 R5.2 | R5.2 26.5,30.85 26.55,30.8 R5.2 | C12.1 26.15,29.75 25.65,30.25 25.65,30.85
N22741
  Top 0.3: R12.1 C21.2
N22792
  Top 0.3: C22.2 R13.1
N22914
  Top 0.15: R15.2 21.2,25.4
  Top 0.3: R14.2 21.76,23.81 21.9,23.95 21.9,25.4 | 21.9,25.4 21.63,25.4 R15.2 | 21.2,25.4 21.7,25.4 | 21.9,25.4 21.9,26.2 21.5,26.6 21.5,27.4 21.22,27.38 20.72,27.73 | R13.2 18.79,31.71 18.9,31.6 18.9,30 18.2,30 R12.2 20.79,30.01 21.5,29.3 21.5,28.15 C26.1
  Top 0.5: 20.72,27.73 C26.1
N23144
  Top 0.3: C23.2 R14.1
N23171
  Top 0.3: R15.1 C24.2
N27571
  Top 0.3: 38.85,16.5 Q3.P$8 38.85,15.46 38.4,15 37.6,15 | Q3.P$7 37.6,15.51 37.6,15.5 Q3.P$7 | Q3.P$6 36.35,15.55 36.35,15 35.7,15 35.1,15.6 Q3.P$5 | 38.9,16.57 38.9,18 37.6,18 | Q3.P$7 37.6,15.01 37.6,15 | 37.6,15 36.58,15 36.58,14.93 | 37.6,18 37.6,16.4 | 37.6,18 36.4,18 35.5,18 35.1,17.6 Q3.P$5 | 36.4,16.5 36.3,16.4 | C29.1 36.59,13.79 36.55,13.8 | 35.1,16.5 Q3.P$5
  Top 0.5: Q3.P$6 36.35,15 | 38.9,16.57 Q3.P$8 | 36.4,18 36.4,16.5 | 36.58,14.93 36.55,14.9
  Top 0.6: T2.3 41.27,23.47 40.4,22.6 40.4,19.5 38.9,18 | 36.55,13.8 36.55,14.9
N27735
  Top 0.15: 35.68,24.82 33.74,24.82 R23.2
  Top 0.3: 35.68,24.82 35.8,24.3 R24.1 36.35,24.55 | 36.35,22.7 36.35,22.6 37.6,22.6 | 37.6,22.6 37.6,21.7 Q3.P$2 37.6,22.59 37.6,22.6 | 37.6,22.6 38.6,22.6 38.8,22.4 38.8,21.5 Q3.P$1
  Top 0.5: 36.35,24.55 Q3.P$3 36.35,22.7
N28455  (via drill 0.3)
  Top 0.15: R23.1 31.59,24.79 31.2,24.4 v27.29,24.39 | v25.8,22.9 25.8,19.2 24.9,18.3 24.9,13.4 25.3,13 U6.14
  Bottom 0.15: v27.29,24.39 v25.8,22.9
N30165  (via drill 0.3)
  Top 0.15: 32.6,13.9 32.62,13.88 v32.56,13.88 32.55,14 32.6,14 32.57,13.97 D11.1 | v23.5,12.8 23.05,12.35 20.46,12.35 U6.4 18.75,12.35 | C36.1 13.72,10.02 14.1,10.4 15.22,10.4 | 15.22,10.4 15.22,11.42 | 15.22,11.42 16.15,12.35 18.75,12.35 | 18.75,12.35 C38.1 | R18.2 27.59,19.38 Q2.2 27.5,18.99 27.5,18.2 27,17.7 v27,15.3 | 15.22,11.42 14.44,11.42 R20.2 | R26.1 15.23,9.39 15.2,9.4 15.22,9.42 15.22,10.4
  Bottom 0.15: v23.5,12.8 25.7,12.8 27,14.1 | 27,14.1 30.1,14.1 30.3,13.9 32.5,13.9 v32.56,13.88 | v27,15.3 27,14.1
N30229
  Top 0.15: R19.1 32.54,17.31 R19.1 D11.2 32.5,16.2 | 32.46,16.11 32.5,16.2 | 32.5,16.2 D11.2
N30416  (via drill 0.3)
  Top 0.15: v19.2,10.1 19.2,6.9 19.23,6.83 19.23,6.81 Q4.3 18.01,6.79 17.9,6.8 D13.2 | v21.65,13.65 20.47,13.65 U6.2
  Bottom 0.15: v19.2,10.1 19.2,11.2 v21.65,13.65
N32035
  Top 0.15: R31.1 24.21,6.01 24,5.8 21.6,5.79 Q4.1 21.53,5.82 21.58,5.82 21.6,5.8 22.9,5.8 22.9,4.2 D15.1
N36998
  Top 0.15: U6.15 27.14,13.65 27.7,14.2 28.1,14.2 28.1,14.19 R22.2
N40108
  Top 0.15: 45.89,43.31 45.8,43.2 45.9,42.95 D14.1 45.9,44.1 | 45.9,44.8 R30.2 45.79,44.81 45.9,44.8 | R32.1 49,46 47.9,46 | 47.9,46 47.2,46 46.9,45.7 46.9,44.5 46.5,44.1 45.9,44.1 | 47.9,46 47.9,45.2 R29.1 | 45.9,44.8 45.9,44.1
N40137
  Top 0.15: C41.1 43.95,40.8 D14.2
  Top 0.3: ISO1.2 45.15,35.5 45.15,36.15 44,37.3 D14.2
N40177
  Top 0.15: 46.8,37.7 C39.1 46.85,37.45 46.7,37.3 46.4,37.3 | 46.4,37.3 45.45,37.3 45.31,37.44 R27.1 | ISO1.1 46.44,37.27 46.4,37.3
N40361
  Top 0.15: R21.1 57.69,18.49 53.7,18.5
  Top 0.3: 56.07,18.39 T2.8
  Top 0.5: 53.7,18.5 53.7,16.9 54.94,15.64 D12.1 | T2.8 56,18.5 53.7,18.5 | 53.7,18.5 53.7,20.7 53.97,20.97 T2.7
N40778
  Top 0.15: R21.2 59.2,18.5 59.6,18.5 59.85,18.75 C37.1
N41567
  Top 0.15: R1.1 97.55,50.95 97.3,51.2 96.7,51.2 D2.1
N62909  (via drill 0.3)
  Top 0.15: R16.1 32.59,21.51 | R18.1 27.59,22.81 v27.6,22.9
  Top 0.3: 28.4,12.9 v28.6,12.85 28.4,12.8 27.5,12.8 27.05,12.35 26.16,12.35 U6.13 | 29.5,11 v31.3,11 31.82,10.48 R17.2 | 32.59,21.51 v32.55,21.5 | v28.5,15.4 28.5,16.9 28.51,16.91 Q2.3
  Top 0.5: L1.2 22.8,16.6 23.12,16.62 23.12,15.62 v23.1,15.5 | C30.1 29.62,10.88 29.5,11 v28.6,11.9 v28.6,12.85 | v44.7,26 v40.9,26 42.76,26 T2.4 42.7,26.06 | v23.2,22 23.2,20.9
  Layer2 0.15: 26,17.3 26.1,17 | v27.6,22.9 28.2,22.6
  pour Layer2: 22.8,27.9 22.8,7.8 37.2,7.8 37.2,9.3 47.3,22.2 47.3,27.9
N62998
  Top 0.15: R16.2 30.6,21.5 30.05,21.5 | D9.C 30.05,22.6 30.05,21.5 | Q2.1 29.5,19.4 29.5,20.95 30.05,21.5
N64947
  Top 0.15: U6.5 19.4,11.7 19.2,11.5 18.7,11.5 18.11,11.51 18.08,11.51 R25.1
N68062  (via drill 0.3)
  Top 0.15: v32.6,19.2 32.55,19.25 R19.2
  Top 0.3: T2.2 43.17,21.07 43.3,21 | 43.2,21 43.3,21 | 43.3,21 v44.9,21
  Bottom 0.3: v44.9,21 41.4,21 39.3,18.9 32.9,18.9 v32.6,19.2
N68837
  Top 0.3: R17.1 34.8,10.5 36.1,10.5 36.5,10.9 36.5,11.5 | 36.5,11.5 36.5,11.6 36.6,11.5 36.5,11.5 | 36.5,11.5 C29.2
N69576  (via drill 0.3)
  Top 0.15: v46.1,18.3 46.1,27.8 46.44,28.14 ISO1.4 | D13.1 16.53,6.87 16.5,6.8 15.6,6.8 | 15.6,6.8 15.24,7.2 R26.2 | 15.56,6.85 v15.45,6.85 15.5,6.8 15.6,6.8 | 15.56,6.85
  Bottom 0.15: v15.45,6.85 16.7,8.1 31,8.1 37.5,14.5 40.3,17.3 45.1,17.3 v46.1,18.3
N69902
  Top 0.15: R30.1 45.89,46.21 45.7,46.4 44.2,46.4 44,46.2 44,45.9 44.07,45.8 C41.2
N70322
  Top 0.15: 48,40.3 47.1,39.4 46.85,39.4 | 46.85,39.4 45.5,39.4 45.31,39.21 R27.2 | R28.1 47.91,40.39 47.95,40.35 48,40.3 | 48,40.3 48.1,40.2 C40.1 | C39.2 46.85,39.4
N98218
  Top 0.15: U1.12 68.51,12.79 68.3,13 C3.1 66.85,13.01 C2.1 66.02,12.96 FB2.2
N100630
  Top 0.15: U1.13 68.39,12.29 68.2,12.1 67.86,12.1 C3.2 66.85,12.05 C2.2 65.99,12.02 FB1.1
N118561  (via drill 0.3)
  Top 0.15: R4.2 88.77,25.64 88.7,25.6 88.75,25.55 88.75,25.15 89,24.9 90.1,24.9 | U1.60 73.57,21.33 v73.4,21.5 | 90.1,24.9 90.8,24.9 91.25,25.35 91.25,26.35 Q1.3 | v90.1,24 90.1,24.9
  Bottom 0.15: v73.4,21.5 73.5,21.3 75.3,19.6 89.3,19.6 90.1,20.4 v90.1,24
N181699  (via drill 0.3)
  Top 0.15: R9.1 11.48,48.28 11.5,48.3 v12.3,48.3 | v40.3,36.7 40.9,36.1 U2.27
  Bottom 0.15: v12.3,48.3 12.7,48.2 14.2,46.8 30.2,46.8 31.4,45.6 31.4,41.2 35.9,36.7 v40.3,36.7
N181770  (via drill 0.3)
  Top 0.15: U2.26 40.26,35.65 v38.4,37.5 | v11.9,49.8 11.9,51.2 11.7,51.4 11.27,51.4 R10.1
  Bottom 0.15: v38.4,37.5 35.9,37.5 31.9,41.5 31.9,45.9 30.5,47.3 14.5,47.3 v11.9,49.8
N182309
  Top 0.15: D4.1 7.15,50.67 | 7.15,50.67 D6.2 | R10.2 10.21,51.41 10.2,51.4 7.35,51.4 7.15,51.2 7.15,50.67
N184903
  Top 0.6: J10.3@1 J10.3@2 8.35,13.9 10.1,13.9 10.88,14.68 D10.A
N205481  (via drill 0.3)
  Top 0.15: 66.55,15.55 66.05,15.55 C4.2 | R2.1 66.55,15.55 | 66.55,15.55 66.55,15.95 v66.2,16.3
  Bottom 0.15: v66.2,16.3 68.6,16.3 68.7,16.4 68.73,16.5 Y1.1
N209164
  Top 0.15: R33.1 92.24,32.19 92.2,32.2 | 92.2,32.2 R3.2 | Q1.1 92.21,29.39 92.2,29.4 92.2,32.2
N230488
  Top 0.15: D3.2 94.86,30.88 94.9,30.9 94.9,31.8 94.51,32.19 R33.2
N$1
  Top 0.15: D5.1 7.15,48.59 | 7.15,48.59 D7.2 | R9.2 10.54,48.19 10.23,48.19 10.15,48.1 10.15,48 10.05,47.9 7.25,47.9 7.15,48 7.15,48.59
N$2
  Top 0.15: U1.3 67.91,17.29 67.7,17.5 67.69,17.5 PC14.TP
N$3
  Top 0.15: U1.4 67.31,16.79 66.7,17.4 65.9,17.4 65.8,17.5 PC15.TP
N$4
  cutout Layer2 (isolate 0.61): 0.1,41.7 2.9,41.7 2.9,34.7 0.1,34.7
  cutout Layer3 (isolate 0.61): 0.1,41.7 2.9,41.7 2.9,34.7 0.1,34.7
  cutout Bottom (isolate 0.61): 0.1,41.7 2.9,41.7 2.9,34.7 0.1,34.7
  cutout Top (isolate 0.61): 0.1,41.7 2.9,41.7 2.9,34.7 0.1,34.7
N$5
  Top 0.15: U1.18 72.07,8.07 70.4,6.4 69.9,6.18 PF4.TP
N$6
  Top 0.15: D1.1 96.4,35.3 96.36,35.39 96.96,35.39 97.1,35.25 97.1,34.9 96.5,34.3 96.5,24.1 94.4,22 94.4,13.1 93.8,12.5 91.83,12.5 J1.2
N$7
  Top 0.15: U1.19 72.57,8.67 72.55,8.65 72.55,8.05 72.3,7.8 72.3,6.66 PF5.TP
N$8
  Top 0.15: U1.28 77.07,8.63 77.1,8.5 77.1,8.1 78,7.2 78,6.86 PB2.TP
N$9
  Top 0.15: U1.53 77.07,22.03 76.95,22.15 76.95,23.39 PC12.TP
N$10
  Bottom 0.25: 2.3,41 1.1,41 1.7,40.4 1.7,41.2
NCTS1  (via drill 0.3)
  Top 0.15: J8.6 86.4,3.3 88.4,5.3 88.4,15.1 v87.4,16.1 | v79.9,16.1 80.1,16.3 81,16.3 81.09,16.29 U1.44
  Bottom 0.15: v87.4,16.1 v79.9,16.1
NDSR2
  Top 0.15: D3.1 94.9,24 93.5,22.6 91.77,22.6 J1.6
NGATE  (via drill 0.3)
  Top 0.15: U6.3 22.41,13.01 v23.7,14.3 | v34,20.4 34.9,20.4 35.1,20.6 35.1,21.6
  Top 0.3: TP3.TP 33.29,22.81 33.8,22.7 34.8,22.7 35.1,22.4 35.1,21.6 Q3.P$4
  Bottom 0.15: v23.7,14.3 24.1,14.7 24.1,16.9 27.7,20.5 33.9,20.5 v34,20.4
NINT_ETH  (via drill 0.3)
  Top 0.15: U2.4 39.6,42.6 v39.6,42.8 | v76.9,30.9 76.9,25.8 78.1,24.6 78.1,20.32 U1.51
  Bottom 0.15: v39.6,42.8 42.2,42.8 47.8,37.2 55.1,37.2 59,33.3 61.1,33.3 62.7,31.7 76.1,31.7 v76.9,30.9
NPWRGD  (via drill 0.3)
  Top 0.15: R31.2 24.2,7.67 24.2,9 24.1,9.1 23.9,9.1 23.5,9.5 v23.5,11 23.6,11 | 24.5,10.99 23.6,11 | 23.6,11 26.16,11 U6.11 | R20.1 12.51,11.39 v12.3,11.4
  Bottom 0.15: J11.2 5,16 9.6,11.4 v12.3,11.4 12.9,11.4 14.1,11.4 16.5,9.1 22.5,9.1 23.5,10.1 v23.5,11
NRES  (via drill 0.3)
  Top 0.15: S1.3 S1.4 93,38.34 93,36.7 92.62,36.33 C1.1 | C1.1 D1.2 | C1.1 92.62,33.92 v92.6,33.9 | v69.1,27.7 68.1,26.7 64.93,26.7 J6.5 63.63,25.13 62.6,24.1 v62.6,20.4 | J3.3 33.02,3.92 33.9,4.8 v48.5,4.8 | v53.2,9.5 59.5,9.5 61.4,11.4 v61.4,14.3 61.4,16.9 v62.6,18.1 | v71,15.2 70.9,15.3 U1.7
  Bottom 0.15: v92.6,33.9 92.6,28.9 91.4,27.7 v69.1,27.7 | v48.5,4.8 v53.2,9.5 | v61.4,14.3 63.2,14.3 64.1,15.2 v71,15.2 | v62.6,20.4 v62.6,18.1
NRES_ETH  (via drill 0.3)
  Top 0.15: U1.52 77.57,22.43 v77.55,22.5 | v35.9,42.8 35.7,42.6 U2.10
  Bottom 0.15: v77.55,22.5 77.5,22.6 77.5,23.1 74.2,26.4 68.2,26.4 67.9,26.7 65.3,26.7 64.9,27.1 64.9,28.5 64.2,29.2 60.7,29.2 53.3,36.6 47.5,36.6 42.1,42 36.7,42 v35.9,42.8
NRTS1  (via drill 0.3)
  Top 0.15: v88.11,16.79 88.9,16 J8.7 | U1.45 82.29,16.79 v82.25,16.75
  Bottom 0.15: v88.11,16.79 82.37,16.79 82.46,16.8 v82.25,16.75
NSS_ETH  (via drill 0.3)
  Top 0.15: U1.33 82.41,10.79 v82.8,10.4 | v35.9,39 35.9,39.8 36.35,40.25 U2.9
  Bottom 0.15: v82.8,10.4 80.8,10.4 78.4,12.7 72.2,18.9 70.5,18.9 67.9,21.5 62.8,21.5 60,24.3 60,26.1 52,34.1 44.6,34.1 40.4,38.3 36.6,38.3 v35.9,39
PB6  (via drill 0.3)
  Top 0.15: J7.5 78.74,47.64 v77.5,46.4 | v74.7,46.3 74.6,46.1 74.6,20.32 U1.58
  Bottom 0.15: v77.5,46.4 74.8,46.4 v74.7,46.3
PB7  (via drill 0.3)
  Top 0.15: J7.6 81.28,43.28 v81.2,43.3 | v73.8,43.1 74.2,42.7 74.2,21.2 74.1,21.1 74.1,20.32 U1.59
  Bottom 0.15: v81.2,43.3 74,43.3 v73.8,43.1
PD2
  Top 0.15: J7.4 76.2,24.8 75.9,24.5 75.9,23.1 76.6,22.4 76.6,20.32 U1.54
PE  (via drill 0.3)
  Top 0.3: v4.2,30 0.5,30
  Top 0.5: C26.2 18.2,27.8 v16.75,27.8 | v4.2,30 4.6,29.6 4.6,28.46 TP10.TP | v2.9,42.7 2.55,42.7 2.15,43.1 2.15,44 | v4.4,45 4.4,45.9 | 2.15,27.3 2.15,33.35 v2.1,33.3
  other vias: 26.1,37.6 23.9,35.6 8.2,36 8.1,29 11,31.1 2.15,26.8 1.2,42.7 10.2,45 8.5,43.9 8.1,38.8 4.9,21.5 10.9,21.6 28.1,39.6 30.4,43.3 30.4,40.9 30.4,38.1 17.2,38.1 17.3,35.05 22.3,37.1 3.6,41.1 5.5,19.5 17.6,22.2 13.85,18.45 3.6,35.1 3.6,38.3
  pour Top: -0.3,46.2 31,46.2 30.9,33.1 21.8,33.1 21.8,18 -0.1,18
  pour Layer3: -0.7,46.1 30.9,46.1 30.8,33.2 21.7,33.2 21.7,18.1 -0.5,18.1
  pour Layer2 (isolate 0.61): -0.9,46.1 30.9,46.1 30.8,34.1 21.3,34.1 21.3,27.1 -0.9,27.1
  pour Bottom: -0.3,46.1 30.9,46.1 30.8,33.2 21.7,33.2 21.7,24.8 -0.1,24.8
PF0  (via drill 0.3)
  Top 0.15: U1.5 67.21,16.29 66.5,17 65.2,17 65.05,17.15 64.44,17.15 C5.2 63.87,17.16 63.8,17.1 63.73,17.14 v63.7,17.1
  Bottom 0.15: v63.7,17.1 61.07,17.1 Y1.2
PF1
  Top 0.15: U1.6 68.69,15.79 68.45,15.55 R2.2 68.08,15.59 R2.2
RJ45-1
  Top 0.3: C16.1 18.07,44.53 18.4,44 18.4,42.97 T1.16
  Top 0.5: J9.1 18.07,42.55 T1.16
RJ45-2
  Top 0.3: T1.14 20.98,44.98 20.8,45.2 20.6,45.2 C14.1
  Top 0.5: J9.2 18.43,41.27 19.2,40.5 20.3,40.5 21,41.2 21,42.91 T1.14
RJ45-3
  Top 0.3: T1.11 24.8,43.02 24.8,43.9 26.02,45.22 26.68,45.22 26.9,45.2 C10.1
  Top 0.5: J9.3 18,40.01 18.5,39.5 23.2,39.5 24.8,41.1 T1.11
RJ45-4-5
  Top 0.3: J9.5 14.04,37.47 15.8,37.75 15.8,38.45 14.1,38.73 J9.4 | C21.1 12.41,30.01 11,28.6 11,26.2 10.5,25.7 6.9,25.7 6.5,26.1 6.5,26.95
  Top 0.5: J9.5 7.76,37.47 6.7,36.4 6.7,27.55 U4.4 6.5,26.95
RJ45-6  (via drill 0.3)
  Top 0.3: C11.1 30.12,35.38 v30.1,35.4 | v25.2,39.6 25.35,39.75 25.25,39.55
  Top 0.5: J9.6 19.09,36.2 21.2,38.3 24,38.3 25.25,39.55 27.3,41.6 27.3,42.89 T1.9
  Bottom 0.3: v30.1,35.4 26.3,39.1 26.2,39.2 25.6,39.2 v25.2,39.6
RJ45-7-8
  Top 0.3: J9.7 13.78,34.92 15.9,34.65 15.9,33.95 13.9,33.6 13,33.6 | 13,33.6 12.51,33.6 J9.8 | C22.1 13.39,31.71 13,32.1 13,33.6 | 13,33.6 12.61,33.59
  Top 0.5: U4.3 9.28,27.38 9.4,27.5 9.4,32 8.7,32.7 8.7,33.3 9,33.6 9.6,33.6 9.68,33.58 9.7,33.6 10.24,33.66 J9.8 | 12.61,33.59 13.9,33.6
RTC  (via drill 0.3)
  Top 0.15: U1.2 68.81,17.79 67.3,19.3 62,19.3 59.5,16.8 59.5,11.6 58.9,11 v52.4,11 | v47.2,5.9 32.6,5.9 29.8,4.6 28.2,3.5 27.9,2.58 J3.1
  Bottom 0.15: v52.4,11 47.3,5.9 v47.2,5.9
RX1  (via drill 0.3)
  Top 0.15: v83.1,44.9 83.1,41.9 83.4,41.6 83.4,16.6 82.6,15.8 U1.43
  Bottom 0.15: J4.1 65.7,50.8 68.4,48.1 79.9,48.1 v83.1,44.9
RX2  (via drill 0.3)
  Top 0.15: 78.8,22.22 v78.8,22.2 78.8,22.1 78.57,21.87 U1.50 | J1.4 91.49,17.7 89.8,17.7 89.1,18.4 89.1,19 v87.3,20.8 87,21.1 87,28.8 v87.3,29.1
  Bottom 0.15: v87.3,20.8 85.9,22.2 v78.8,22.2 | J2.3 36.58,49.92 39.1,47.4 45.3,47.4 50,42.7 63.8,42.7 73.3,33.2 83.2,33.2 v87.3,29.1
SCK1  (via drill 0.3)
  Top 0.15: J6.3 63.63,28.17 62.4,29.4 62.4,35.2 v62.3,35.3 | U1.55 76.07,21.87 v76.05,21.9
  Bottom 0.15: J2.6 28.96,49.54 29.7,48.8 31.6,48.8 35.1,45.3 42.7,45.3 48.8,39.2 55.7,39.2 58.3,36.6 61,36.6 v62.3,35.3 | v76.05,21.9 76.05,23.15 73.8,25.4 68.8,25.4 67.4,24 65.6,24 64.9,24.7 64.9,26.1 64,27 64,27.57 J6.3
SCK_ETH  (via drill 0.3)
  Top 0.15: U2.8 37.01,39.6 v36.8,39.4 | v83.7,11.3 U1.34
  Bottom 0.15: v36.8,39.4 37.4,38.8 40.8,38.8 44.8,34.8 52.2,34.8 60.6,26.4 60.6,24.5 63.1,22 68.2,22 70.6,19.6 72.2,19.6 80.5,11.3 v83.7,11.3
SCL1  (via drill 0.3)
  Top 0.15: 87.2,46.9 87.19,46.89 R34.2 86.51,46.89 86.5,46.9 87.2,46.9 | 87.2,46.9 87.2,47.2 86.5,47.9 86.48,50.67 J7.8 | 87.2,46.9 87.2,38.1 86.6,37.5 86.6,19.9 87.6,18.9 v87.6,18.5 | v79.3,17.8 79.3,19 79,19.3 73.3,19.3 73.1,19.5 73.1,20.22 U1.61
  Bottom 0.15: v87.6,18.5 87.3,18.2 79.7,18.2 v79.3,17.8
SCL2  (via drill 0.3)
  Top 0.15: U1.47 81.89,17.79 83,18.9 83,31.6 82.5,32.1 v81.5,32.1
  Bottom 0.15: J2.10 18.8,50.3 21.3,47.8 30.8,47.8 34.7,43.9 41.9,43.9 48.1,37.7 55.4,37.7 59.2,33.9 61.6,33.9 63.3,32.2 81.4,32.2 v81.5,32.1
SDA1  (via drill 0.3)
  Top 0.15: J7.7 83.56,50.53 R35.2 83.6,46.9 83.59,46.89 83.59,46.51 83.8,46.3 86.4,46.3 86.8,45.9 86.8,38.4 86.2,37.8 86.2,19.2 v86.55,18.85 | v78.6,18.6 78.3,18.9 73,18.9 72.6,19.3 72.6,20.22 U1.62
  Bottom 0.15: v86.55,18.85 86.45,18.9 78.9,18.9 v78.6,18.6
SDA2  (via drill 0.3)
  Top 0.15: U1.48 81.29,18.29 81.3,18.3 81.8,18.3 82.6,19.1 82.6,31 v82.3,31.3
  Bottom 0.15: J2.9 21.34,49.66 22.7,48.3 31.2,48.3 34.9,44.6 42.3,44.6 48.6,38.3 55.6,38.3 59.4,34.5 62.2,34.5 64,32.7 81.9,32.7 82.3,32.3 v82.3,31.3
SPR1  (via drill 0.3)
  Top 0.15: U1.37 83.3,12.8 85.8,15.3 85.8,38.1 86.4,38.7 86.4,43.4 v85.7,44.1
  Bottom 0.15: J7.1 68.58,49.32 69.3,48.6 81.2,48.6 v85.7,44.1
SPR2  (via drill 0.3)
  Top 0.15: J7.2 71.12,45.98 v73,44.1 | U1.38 81.5,13.3 83.13,13.3 85.4,15.57 85.4,38.4 86,39 86,42.3 v84.2,44.1
  Bottom 0.15: v73,44.1 v84.2,44.1
SWD  (via drill 0.3)
  Top 0.15: v89.31,16.89 89.3,16.8 89.3,5.8 91.5,3.6 91.5,2.6 J8.8 | U1.46 81.4,17.3 81.44,17.34 81.99,17.34 82.25,17.5 82.7,17.5 v82.75,17.55
  Bottom 0.15: v89.31,16.89 89.27,16.99 88.76,17.5 82.75,17.5 v82.75,17.55
TX1  (via drill 0.3)
  Top 0.15: v83.9,42.6 83.8,42.5 83.8,16.4 82.7,15.3 U1.42
  Bottom 0.15: v83.9,42.6 83.2,41.9 73.2,41.9 66.2,48.9 62.7,48.9 62,49.6 61.7,49.6 61.5,49.8 61.5,50.26 J4.2
TX2  (via drill 0.3)
  Top 0.15: U1.49 79.1,20.42 79.1,21.3 79.8,22 79.8,22.8 v79.1,23.5 79.1,35.9 78.5,36.5 78.5,43.8 v77.5,44.8 | v73.3,45.5 73.3,47 73.7,47.4 73.7,50.76 J7.3 | v89,20.9 89.9,20 J1.5
  Bottom 0.15: v77.5,44.8 74,44.8 v73.3,45.5 | v79.1,23.5 86.4,23.5 v89,20.9
V+  (via drill 0.3)
  Top 0.3: 17.25,18.25 17.3,18.3
  Top 0.5: v17.1,15.4 16,15.4 | 16,15.4 15.7,15.4 15.85,13.95 v17.1,13.95 | v19.4,22 19.42,21.88 19.42,20.72 19.4,20.7 L1.1 19.32,20.52 19,20.2 19,18.7 18.2,18.7 17.3,18.3 | v19.6,15.5 19.6,16.6 19.5,16.7 | U3.1 12.63,21.32 12.5,21.3 12.7,21.4 12.7,21.5 12.63,21.53 12.7,21.6 v12.7,22.8 | C25.1 12,18.9 12.7,18.9 13.15,19.35 13.15,19.65 12.8,20 v12.65,20 12.65,21.3 12.6,21.3 | v3.3,23.2 3.3,24.6 3.1,24.8 D8.1 2.3,24.8 2.1,24.6 v2.1,23.2 | 6.7,20.7 6.8,20.85 U4.1 | v6.7,22.7 6.7,21.3 6.9,20.8 6.7,20.7 | 6.7,20.7 v6.7,20 | V+.TP 17.25,18.25 | D10.C 16,14.68 16,15.4
  Layer2 0.5: v17.1,13.95 v17.1,15.4 | v19.4,22 19.2,22.2
  pour Layer2: -0.4,25.6 21.7,25.6 21.7,-0.3 -0.4,-0.4
VPORTN  (via drill 0.3)
  Top 0.15: R25.2 16.8,11.5 16.7,11.4 16.7,11 17.1,10.6 v17.3,10.6
  Top 0.3: v21.6,10.4 U6.7 | v27.45,11.7 v24.9,11.7 U6.12 | VPORTN.TP 15.58,18.52 15.6,18.6 v15.6,20.1
  Top 0.5: C25.2 10.2,19.1 9.97,18.87 9.95,18.9 9.87,18.88 9.22,18.88 9,19.1 v9,19.6 9,19.85 9.3,20.15 9.3,21 | 15.3,21.6 15.3,20.4 v15.6,20.1 | v9.31,22.7 U4.2 | v21.6,11.3 v21.6,10.4 | U3.2 14.92,21.07
  Top 0.6: D8.2 3.1,20.4 3.1,19.9 2.1,20.5 v2.1,22 | 9.3,21 U4.2 | U3.2 15.27,22.63 15.3,21.6 | 3.3,20.5 v3.3,22
  other vias: 15.3,22.7
  pour Bottom: 22.4,23 0.3,23 0.4,19 8.6,19 18.3,9.3 29.6,9.3 29.6,16.1 22.4,16.1

## Text on the board
Top: 1
Layer2: 2
Layer3: 3
bStop: ELL-i proto 1.0 | www.ell-i.org
_tsilk: c | STATUS | c | c | VDD | J2 | J4 | J7 | LINK | RESET | J6 | PC12 | FTDI | TP3 | VPN | V+ | PC15 | PC14 | www.ell-i.org | GND | c | PF4/5 | PB2 | c | J3 | J5 | J8